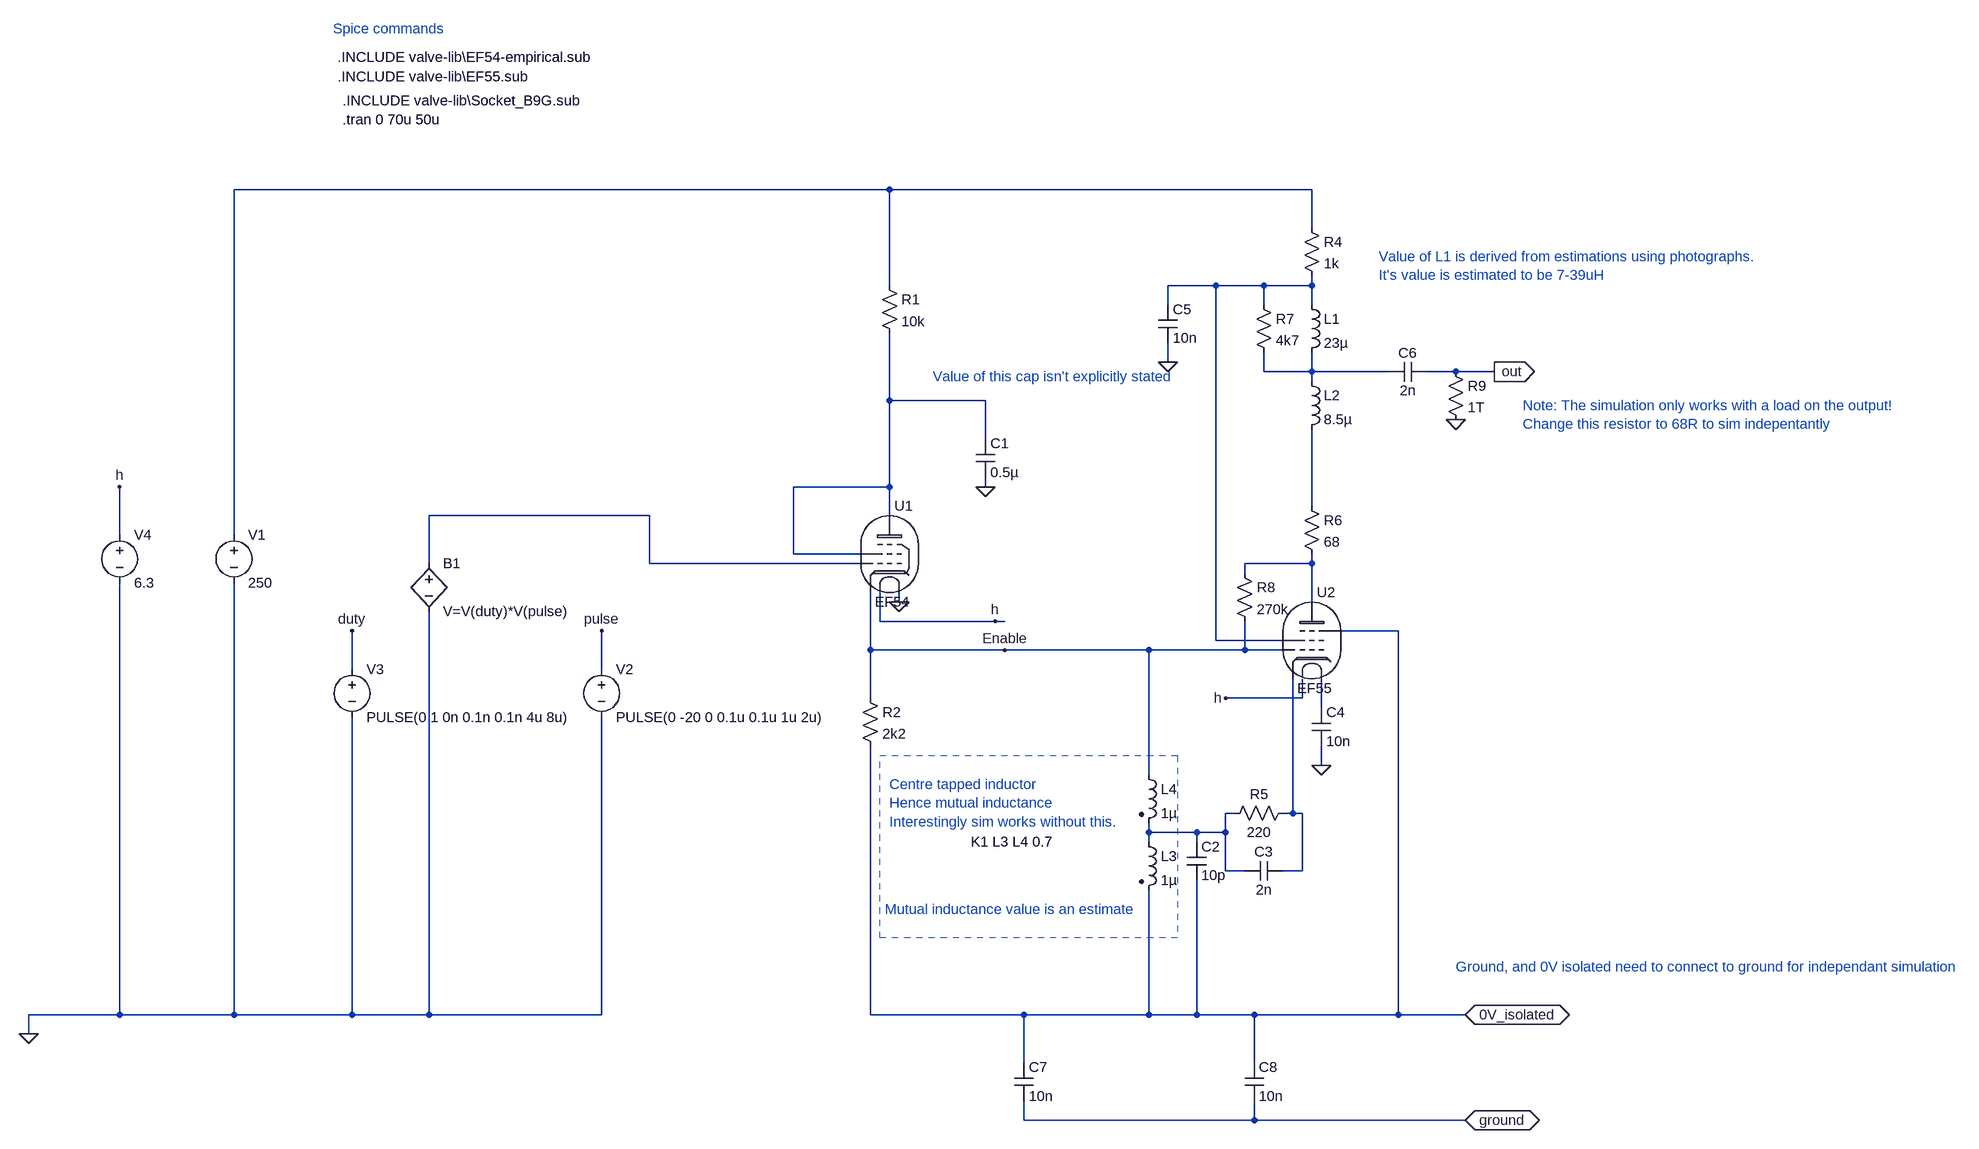
[diagram p0: schematic store_regen_output.asc]
store_regen_output.asc, the LTspice schematic file:
Version 4
SHEET 1 2452 1160
WIRE 208 -464 -960 -464
WIRE 912 -464 208 -464
WIRE 912 -400 912 -464
WIRE 208 -304 208 -464
WIRE 752 -304 672 -304
WIRE 832 -304 752 -304
WIRE 912 -304 912 -320
WIRE 912 -304 832 -304
WIRE 672 -272 672 -304
WIRE 832 -272 832 -304
WIRE 912 -272 912 -304
WIRE 672 -176 672 -208
WIRE 832 -160 832 -192
WIRE 912 -160 912 -192
WIRE 912 -160 832 -160
WIRE 1040 -160 912 -160
WIRE 1152 -160 1104 -160
WIRE 1216 -160 1152 -160
WIRE 912 -144 912 -160
WIRE 208 -112 208 -224
WIRE 368 -112 208 -112
WIRE 368 -48 368 -112
WIRE 208 32 208 -112
WIRE 208 32 48 32
WIRE 368 32 368 16
WIRE 912 64 912 -64
WIRE -192 80 -560 80
WIRE 208 80 208 32
WIRE -1184 112 -1184 32
WIRE -960 112 -960 -464
WIRE 48 144 48 32
WIRE 160 144 48 144
WIRE -560 160 -560 80
WIRE -192 160 -192 80
WIRE 160 160 -192 160
WIRE 912 160 912 144
WIRE 912 160 800 160
WIRE 800 176 800 160
WIRE 224 224 224 208
WIRE 912 224 912 160
WIRE 192 256 192 208
WIRE 384 256 192 256
WIRE 400 256 384 256
WIRE 1056 272 960 272
WIRE 752 288 752 -304
WIRE 864 288 752 288
WIRE 176 304 176 208
WIRE 400 304 176 304
WIRE 640 304 400 304
WIRE 800 304 800 256
WIRE 800 304 640 304
WIRE 864 304 800 304
WIRE -688 336 -688 272
WIRE -272 336 -272 272
WIRE 176 384 176 304
WIRE 896 384 896 352
WIRE 896 384 768 384
WIRE 928 400 928 352
WIRE 928 496 928 464
WIRE 640 512 640 304
WIRE 784 576 768 576
WIRE 880 576 880 352
WIRE 880 576 864 576
WIRE 896 576 880 576
WIRE 640 608 640 592
WIRE 720 608 640 608
WIRE 768 608 768 576
WIRE 768 608 720 608
WIRE 640 624 640 608
WIRE 720 624 720 608
WIRE 768 672 768 608
WIRE 800 672 768 672
WIRE 896 672 896 576
WIRE 896 672 864 672
WIRE -1184 912 -1184 192
WIRE -1184 912 -1472 912
WIRE -960 912 -960 192
WIRE -960 912 -1184 912
WIRE -688 912 -688 416
WIRE -688 912 -960 912
WIRE -560 912 -560 240
WIRE -560 912 -688 912
WIRE -272 912 -272 416
WIRE -272 912 -560 912
WIRE 176 912 176 464
WIRE 432 912 176 912
WIRE 640 912 640 704
WIRE 640 912 432 912
WIRE 720 912 720 688
WIRE 720 912 640 912
WIRE 816 912 720 912
WIRE 1056 912 1056 272
WIRE 1056 912 816 912
WIRE 1168 912 1056 912
WIRE -1472 944 -1472 912
WIRE 432 992 432 912
WIRE 816 992 816 912
WIRE 432 1088 432 1056
WIRE 816 1088 816 1056
WIRE 816 1088 432 1088
WIRE 1168 1088 816 1088
FLAG 368 32 0
FLAG 400 304 Enable
FLAG -1472 944 0
FLAG 672 -176 0
FLAG 928 496 0
FLAG 384 256 h
FLAG 768 384 h
FLAG 224 224 0
FLAG -688 272 duty
FLAG -272 272 pulse
FLAG -1184 32 h
FLAG 1216 -160 out
IOPIN 1216 -160 Out
FLAG 1152 -80 0
FLAG 1168 912 0V_isolated
IOPIN 1168 912 BiDir
FLAG 1168 1088 ground
IOPIN 1168 1088 BiDir
SYMBOL EF54 208 144 R0
SYMATTR InstName U1
SYMBOL voltage -960 96 R0
WINDOW 123 0 0 Left 2
WINDOW 39 0 0 Left 2
SYMATTR InstName V1
SYMATTR Value 250
SYMBOL res 192 -320 R0
SYMATTR InstName R1
SYMATTR Value 10k
SYMBOL res 160 368 R0
SYMATTR InstName R2
SYMATTR Value 2k2
SYMBOL cap 352 -48 R0
SYMATTR InstName C1
SYMATTR Value 0.5µ
SYMBOL voltage -272 320 R0
WINDOW 123 0 0 Left 2
WINDOW 39 0 0 Left 2
SYMATTR InstName V2
SYMATTR Value PULSE(0 -20 0 0.1u 0.1u 1u 2u)
SYMBOL EF55 912 288 R0
SYMATTR InstName U2
SYMBOL res 896 -416 R0
SYMATTR InstName R4
SYMATTR Value 1k
SYMBOL ind 896 -288 R0
SYMATTR InstName L1
SYMATTR Value 23µ
SYMBOL ind 896 -160 R0
SYMATTR InstName L2
SYMATTR Value 8.5µ
SYMBOL ind2 624 608 R0
SYMATTR InstName L3
SYMATTR Value 1µ
SYMATTR Type ind
SYMBOL cap 704 624 R0
SYMATTR InstName C2
SYMATTR Value 10p
SYMBOL cap 864 656 R90
WINDOW 0 0 32 VBottom 2
WINDOW 3 32 32 VTop 2
SYMATTR InstName C3
SYMATTR Value 2n
SYMBOL res 880 560 R90
WINDOW 0 0 56 VBottom 2
WINDOW 3 32 56 VTop 2
SYMATTR InstName R5
SYMATTR Value 220
SYMBOL ind2 624 496 R0
SYMATTR InstName L4
SYMATTR Value 1µ
SYMATTR Type ind
SYMBOL cap 912 400 R0
SYMATTR InstName C4
SYMATTR Value 10n
SYMBOL res 896 48 R0
SYMATTR InstName R6
SYMATTR Value 68
SYMBOL res 816 -288 R0
SYMATTR InstName R7
SYMATTR Value 4k7
SYMBOL cap 656 -272 R0
SYMATTR InstName C5
SYMATTR Value 10n
SYMBOL cap 1104 -176 R90
WINDOW 0 0 32 VBottom 2
WINDOW 3 32 32 VTop 2
SYMATTR InstName C6
SYMATTR Value 2n
SYMBOL res 784 160 R0
SYMATTR InstName R8
SYMATTR Value 270k
SYMBOL voltage -688 320 R0
WINDOW 123 0 0 Left 2
WINDOW 39 0 0 Left 2
SYMATTR InstName V3
SYMATTR Value PULSE(0 1 0n 0.1n 0.1n 4u 8u)
SYMBOL bv -560 144 R0
SYMATTR InstName B1
SYMATTR Value V=V(duty)*V(pulse)
SYMBOL voltage -1184 96 R0
WINDOW 123 0 0 Left 2
WINDOW 39 0 0 Left 2
SYMATTR InstName V4
SYMATTR Value 6.3
SYMBOL cap 416 992 R0
SYMATTR InstName C7
SYMATTR Value 10n
SYMBOL cap 800 992 R0
SYMATTR InstName C8
SYMATTR Value 10n
SYMBOL res 1136 -176 R0
SYMATTR InstName R9
SYMATTR Value 1T
TEXT -712 -736 Left 2 !.INCLUDE valve-lib\\EF54-empirical.sub
TEXT -704 -632 Left 2 !.tran 0 70u 50u
TEXT -720 -784 Left 2 ;Spice commands
TEXT 280 -152 Left 2 ;Value of this cap isn't explicitly stated
TEXT -712 -704 Left 2 !.INCLUDE valve-lib\\EF55.sub
TEXT -704 -664 Left 2 !.INCLUDE valve-lib\\Socket_B9G.sub
TEXT 1024 -352 Left 2 ;Value of L1 is derived from estimations using photographs.\nIt's value is estimated to be 7-39uH
TEXT 1264 -104 Left 2 ;Note: The simulation only works with a load on the output!\nChange this resistor to 68R to sim indepentantly
TEXT 208 528 Left 2 ;Centre tapped inductor\nHence mutual inductance\nInterestingly sim works without this.
TEXT 344 624 Left 2 !K1 L3 L4 0.7
TEXT 200 736 Left 2 ;Mutual inductance value is an estimate
TEXT 1152 832 Left 2 ;Ground, and 0V isolated need to connect to ground for independant simulation
RECTANGLE Normal 192 480 688 784 2

The netlist it stands for:
* store_regen_output.asc
XU1 N006 N004 N004 Enable 0 h EF54  ; pins G1 G2 Anode Cathode Heater_R Heater_L
V1 N001 0 250
R1 N001 N004 10k
R2 Enable 0V_isolated 2k2
C1 N004 0 0.5µ
V2 pulse 0 PULSE(0 -20 0 0.1u 0.1u 1u 2u)
XU2 Enable N002 N007 N010 N008 h 0V_isolated EF55  ; pins G1 G2 Anode Cathode Heater_R Heater_L G3
R4 N001 N002 1k
L1 N002 N003 23µ
L2 N003 N005 8.5µ
L3 N009 0V_isolated 1µ
C2 N009 0V_isolated 10p
C3 N010 N009 2n
R5 N010 N009 220
L4 Enable N009 1µ
C4 N008 0 10n
R6 N005 N007 68
R7 N002 N003 4k7
C5 N002 0 10n
C6 out N003 2n
R8 N007 Enable 270k
V3 duty 0 PULSE(0 1 0n 0.1n 0.1n 4u 8u)
B1 N006 0 V=V(duty)*V(pulse)
V4 h 0 6.3
C7 0V_isolated ground 10n
C8 0V_isolated ground 10n
R9 out 0 1T
.INCLUDE valve-lib\EF54-empirical.sub
.tran 0 70u 50u
* Spice commands
* Value of this cap isn't explicitly stated
.INCLUDE valve-lib\EF55.sub
.INCLUDE valve-lib\Socket_B9G.sub
* Value of L1 is derived from estimations using photographs.
* It's value is estimated to be 7-39uH
* Note: The simulation only works with a load on the output!
* Change this resistor to 68R to sim indepentantly
* Centre tapped inductor
* Hence mutual inductance
* Interestingly sim works without this.
K1 L3 L4 0.7
* Mutual inductance value is an estimate
* Ground, and 0V isolated need to connect to ground for independant simulation
.backanno
.end